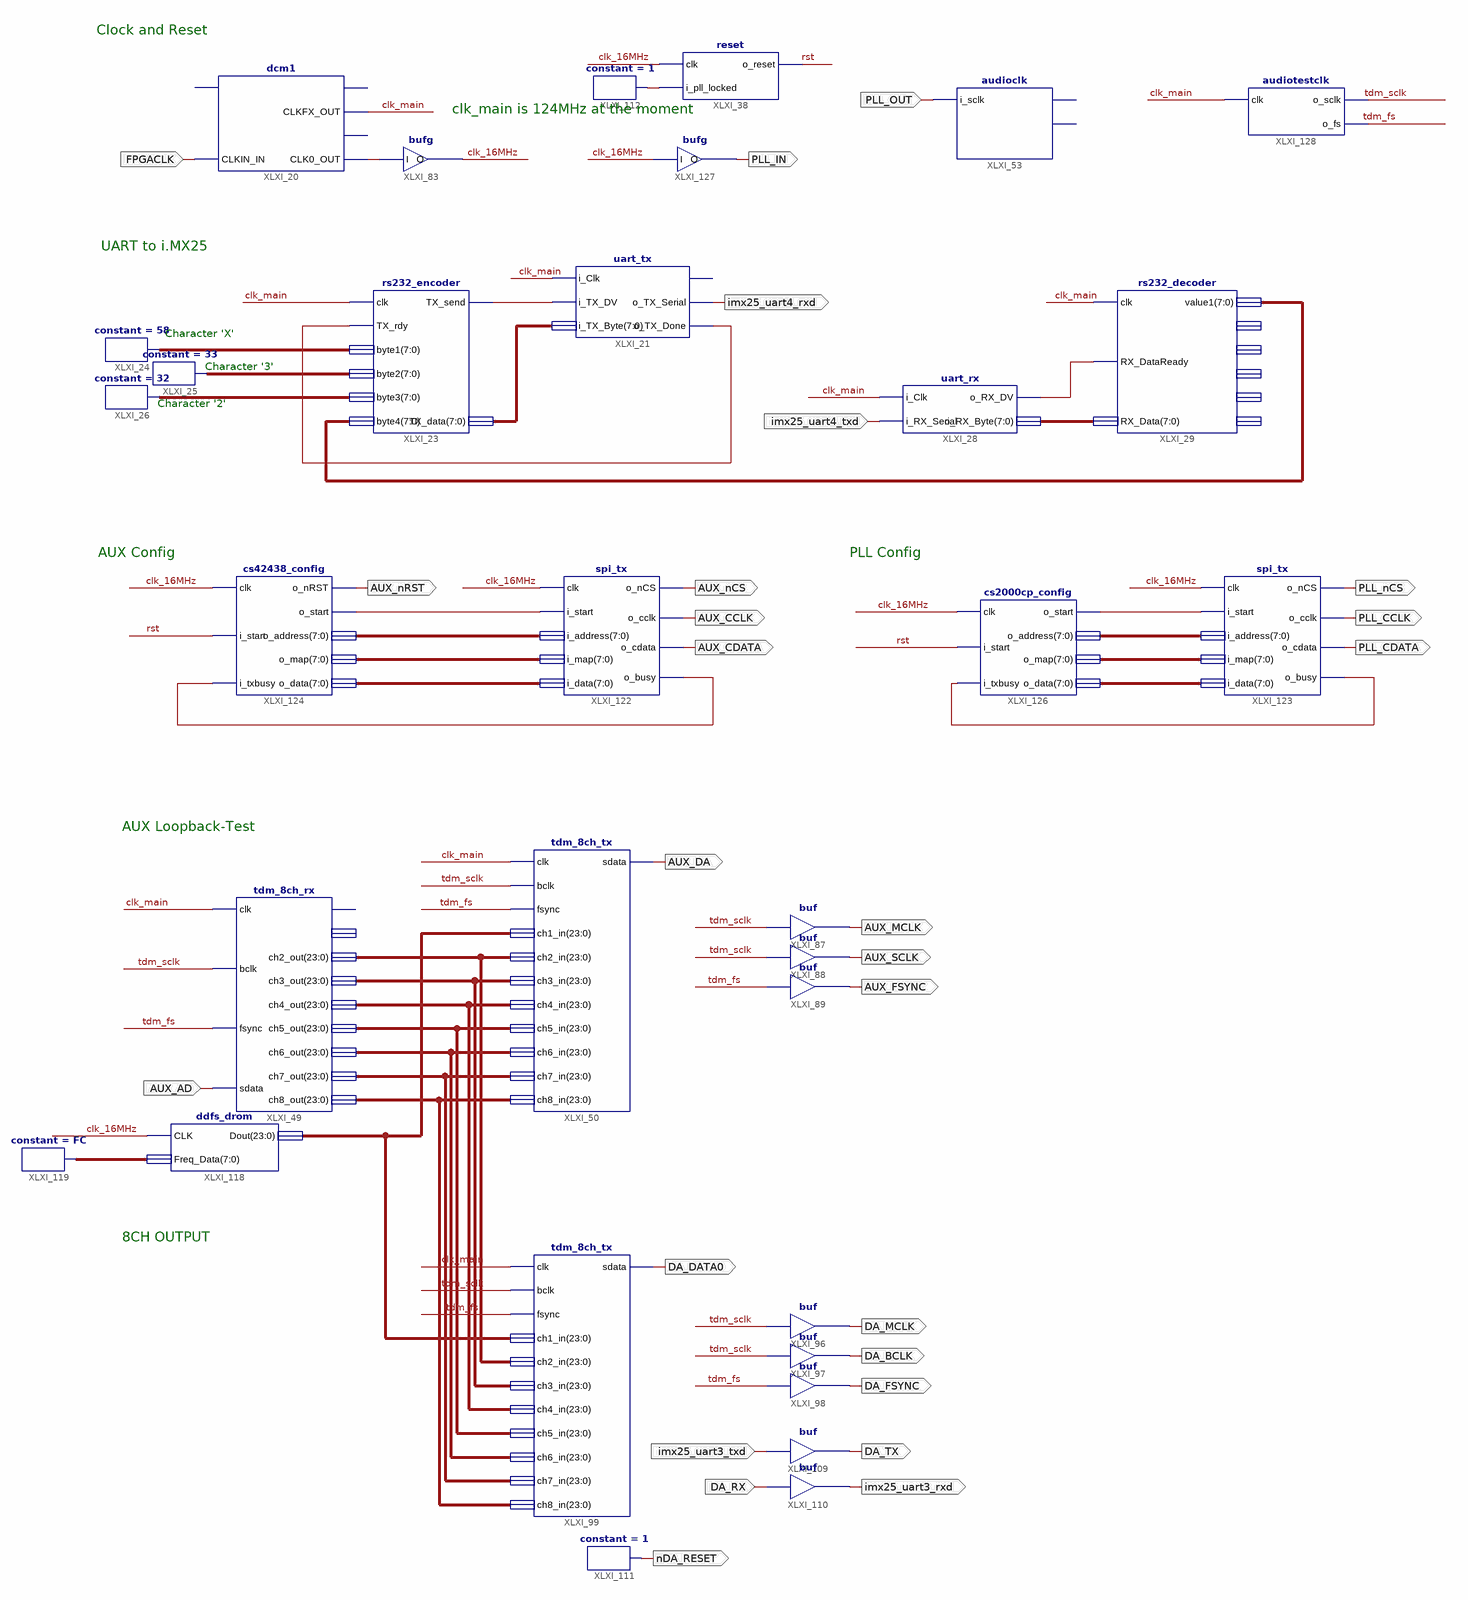
[diagram p0: schematic sheet 1]
// Xilinx ISE schematic main.sch (spartan3a) as structural Verilog: 32 symbols, 26 ports
module main (
  input  imx25_uart4_txd,
  input  PLL_OUT,
  input  AUX_AD,
  input  imx25_uart3_txd,
  input  DA_RX,
  input  FPGACLK,
  output AUX_nRST,
  output AUX_nCS,
  output AUX_CCLK,
  output AUX_CDATA,
  output imx25_uart4_rxd,
  output PLL_nCS,
  output PLL_CCLK,
  output PLL_CDATA,
  output AUX_DA,
  output AUX_MCLK,
  output AUX_SCLK,
  output AUX_FSYNC,
  output DA_MCLK,
  output DA_BCLK,
  output DA_FSYNC,
  output DA_DATA0,
  output DA_TX,
  output imx25_uart3_rxd,
  output nDA_RESET,
  output PLL_IN
);

  wire clk_16MHz, clk_main, rst, tdm_fs, tdm_sclk, XLXN_50, XLXN_54, XLXN_63, XLXN_70, XLXN_222, XLXN_226,
       XLXN_320, XLXN_330, XLXN_346;
  wire [7:0] XLXN_52, XLXN_55, XLXN_56, XLXN_57, XLXN_62, XLXN_65, XLXN_67, XLXN_68, XLXN_69, XLXN_223,
       XLXN_224, XLXN_225, XLXN_342;
  wire [23:0] XLXN_355, XLXN_356, XLXN_357, XLXN_358, XLXN_359, XLXN_360, XLXN_367, XLXN_368;

  dcm1 XLXI_20 (
    .CLKIN_IN(FPGACLK), .CLKFX_OUT(clk_main), .CLK0_OUT(XLXN_330));  // open: RST_IN, LOCKED_OUT, CLKIN_IBUFG_OUT
  reset XLXI_38 (.clk(clk_16MHz), .i_pll_locked(XLXN_320), .o_reset(rst));
  rs232_encoder XLXI_23 (
    .clk(clk_main), .TX_rdy(XLXN_54), .byte1(XLXN_55), .byte2(XLXN_56), .byte3(XLXN_57), .byte4(XLXN_65),
    .TX_send(XLXN_50), .TX_data(XLXN_52));
  constant #(.CValue("33")) XLXI_25 (.O(XLXN_56));
  constant #(.CValue("58")) XLXI_24 (.O(XLXN_55));
  constant #(.CValue("32")) XLXI_26 (.O(XLXN_57));
  audioclk XLXI_53 (.i_sclk(PLL_OUT));  // open: o_sclk, o_fs
  uart_tx XLXI_21 (
    .i_Clk(clk_main), .i_TX_DV(XLXN_50), .i_TX_Byte(XLXN_52), .o_TX_Serial(imx25_uart4_rxd),
    .o_TX_Done(XLXN_54));  // open: o_TX_Active
  uart_rx XLXI_28 (.i_Clk(clk_main), .i_RX_Serial(imx25_uart4_txd), .o_RX_DV(XLXN_63), .o_RX_Byte(XLXN_62));
  rs232_decoder XLXI_29 (
    .clk(clk_main), .RX_DataReady(XLXN_63), .RX_Data(XLXN_62), .value1(XLXN_65));  // open: value2, value3, value4, value5, value6
  tdm_8ch_rx XLXI_49 (
    .clk(clk_main), .bclk(tdm_sclk), .fsync(tdm_fs), .sdata(AUX_AD), .ch2_out(XLXN_355), .ch3_out(XLXN_356),
    .ch4_out(XLXN_357), .ch5_out(XLXN_358), .ch6_out(XLXN_359), .ch7_out(XLXN_360), .ch8_out(XLXN_367));  // open: sync_out, ch1_out
  tdm_8ch_tx XLXI_50 (
    .clk(clk_main), .bclk(tdm_sclk), .fsync(tdm_fs), .ch1_in(XLXN_368), .ch2_in(XLXN_355), .ch3_in(XLXN_356),
    .ch4_in(XLXN_357), .ch5_in(XLXN_358), .ch6_in(XLXN_359), .ch7_in(XLXN_360), .ch8_in(XLXN_367),
    .sdata(AUX_DA));
  buf XLXI_87 (AUX_MCLK, tdm_sclk);
  buf XLXI_88 (AUX_SCLK, tdm_sclk);
  buf XLXI_89 (AUX_FSYNC, tdm_fs);
  tdm_8ch_tx XLXI_99 (
    .clk(clk_main), .bclk(tdm_sclk), .fsync(tdm_fs), .ch1_in(XLXN_368), .ch2_in(XLXN_355), .ch3_in(XLXN_356),
    .ch4_in(XLXN_357), .ch5_in(XLXN_358), .ch6_in(XLXN_359), .ch7_in(XLXN_360), .ch8_in(XLXN_367),
    .sdata(DA_DATA0));
  buf XLXI_96 (DA_MCLK, tdm_sclk);
  buf XLXI_97 (DA_BCLK, tdm_sclk);
  buf XLXI_98 (DA_FSYNC, tdm_fs);
  buf XLXI_109 (DA_TX, imx25_uart3_txd);
  buf XLXI_110 (imx25_uart3_rxd, DA_RX);
  constant #(.CValue("1")) XLXI_111 (.O(nDA_RESET));
  constant #(.CValue("1")) XLXI_112 (.O(XLXN_320));
  bufg XLXI_83 (.I(XLXN_330), .O(clk_16MHz));
  ddfs_drom XLXI_118 (.CLK(clk_16MHz), .Freq_Data(XLXN_342), .Dout(XLXN_368));
  constant #(.CValue("FC")) XLXI_119 (.O(XLXN_342));
  spi_tx XLXI_122 (
    .clk(clk_16MHz), .i_start(XLXN_346), .i_address(XLXN_67), .i_map(XLXN_68), .i_data(XLXN_69),
    .o_nCS(AUX_nCS), .o_cclk(AUX_CCLK), .o_cdata(AUX_CDATA), .o_busy(XLXN_70));
  spi_tx XLXI_123 (
    .clk(clk_16MHz), .i_start(XLXN_222), .i_address(XLXN_223), .i_map(XLXN_224), .i_data(XLXN_225),
    .o_nCS(PLL_nCS), .o_cclk(PLL_CCLK), .o_cdata(PLL_CDATA), .o_busy(XLXN_226));
  cs42438_config XLXI_124 (
    .clk(clk_16MHz), .i_start(rst), .i_txbusy(XLXN_70), .o_nRST(AUX_nRST), .o_start(XLXN_346),
    .o_address(XLXN_67), .o_map(XLXN_68), .o_data(XLXN_69));
  cs2000cp_config XLXI_126 (
    .clk(clk_16MHz), .i_start(rst), .i_txbusy(XLXN_226), .o_start(XLXN_222), .o_address(XLXN_223),
    .o_map(XLXN_224), .o_data(XLXN_225));
  bufg XLXI_127 (.I(clk_16MHz), .O(PLL_IN));
  audiotestclk XLXI_128 (.clk(clk_main), .o_sclk(tdm_sclk), .o_fs(tdm_fs));

  // Notes on the sheet:
  //   Clock and Reset
  //   clk_main is 124MHz at the moment
  //   UART to i.MX25
  //   Character 'X'
  //   Character '3'
  //   Character '2'
  //   AUX Config
  //   PLL Config
  //   AUX Loopback-Test
  //   8CH OUTPUT
endmodule
